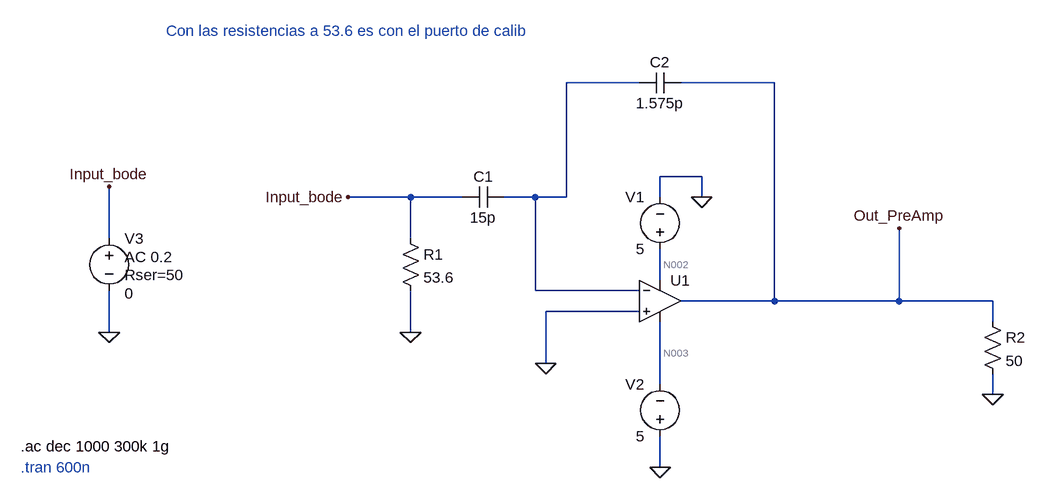
[diagram p0: schematic preamp_calib.asc]
preamp_calib.asc, the LTspice schematic file:
Version 4
SHEET 1 1032 680
WIRE 432 -64 320 -64
WIRE 640 -64 496 -64
WIRE 528 80 464 80
WIRE 80 112 -16 112
WIRE 160 112 80 112
WIRE 272 112 224 112
WIRE 320 112 320 -64
WIRE 320 112 272 112
WIRE 464 112 464 80
WIRE 528 112 528 80
WIRE -384 176 -384 96
WIRE 80 176 80 112
WIRE 464 240 464 192
WIRE 272 256 272 112
WIRE 432 256 272 256
WIRE 640 272 640 -64
WIRE 640 272 496 272
WIRE 832 272 832 160
WIRE 832 272 640 272
WIRE 976 272 832 272
WIRE 432 288 288 288
WIRE 976 304 976 272
WIRE -384 320 -384 256
WIRE 80 320 80 256
WIRE 288 368 288 288
WIRE 464 400 464 304
WIRE 976 416 976 384
WIRE 464 528 464 480
FLAG -384 320 0
FLAG -384 96 Input_bode
FLAG 464 528 0
FLAG 528 112 0
FLAG 288 368 0
FLAG 832 160 Out_PreAmp
FLAG -16 112 Input_bode
FLAG 80 320 0
FLAG 976 416 0
SYMBOL voltage 464 208 R180
WINDOW 0 24 96 Left 2
WINDOW 3 24 16 Left 2
WINDOW 123 0 0 Left 0
WINDOW 39 0 0 Left 0
SYMATTR InstName V1
SYMATTR Value 5
SYMBOL voltage 464 496 R180
WINDOW 0 24 96 Left 2
WINDOW 3 24 16 Left 2
WINDOW 123 0 0 Left 0
WINDOW 39 0 0 Left 0
SYMATTR InstName V2
SYMATTR Value 5
SYMBOL OpAmps\\UniversalOpAmp1 464 272 R0
SYMATTR InstName U1
SYMATTR Value2 Avol=1900 GBW=897.0831Meg Vos=0
SYMBOL voltage -384 160 R0
WINDOW 123 24 44 Left 2
WINDOW 39 24 72 Left 2
WINDOW 3 24 100 Left 2
SYMATTR Value2 AC 0.2
SYMATTR SpiceLine Rser=50
SYMATTR Value 0
SYMATTR InstName V3
SYMBOL cap 224 96 R90
WINDOW 0 0 32 VBottom 2
WINDOW 3 32 32 VTop 2
SYMATTR InstName C1
SYMATTR Value 15p
SYMATTR SpiceLine Rser=0
SYMBOL cap 496 -80 R90
WINDOW 0 0 32 VBottom 2
WINDOW 3 32 32 VTop 2
SYMATTR InstName C2
SYMATTR Value 1.575p
SYMATTR SpiceLine Rser=0
SYMBOL res 64 160 R0
SYMATTR InstName R1
SYMATTR Value 53.6
SYMBOL res 960 288 R0
SYMATTR InstName R2
SYMATTR Value 50
TEXT -520 528 Left 2 ;.tran 600n
TEXT -520 496 Left 2 !.ac dec 1000 300k 1g
TEXT -296 -144 Left 2 ;Con las resistencias a 53.6 es con el puerto de calib

The netlist it stands for:
* preamp_calib.asc
V1 N002 0 5
V2 0 N003 5
XU1 0 N001 N002 N003 Out_PreAmp level1 Avol=1900 GBW=897.0831Meg Vos=0 En=0 Enk=0 In=0 Ink=0 Rin=500Meg  ; pins In+ In- V+ V- OUT
V3 Input_bode 0 0 AC 0.2 Rser=50
C1 N001 Input_bode 15p Rser=0
C2 Out_PreAmp N001 1.575p Rser=0
R1 Input_bode 0 53.6
R2 Out_PreAmp 0 50
* .tran 600n
.ac dec 1000 300k 1g
* Con las resistencias a 53.6 es con el puerto de calib
.lib UniversalOpAmp1.lib
.backanno
.end

* Results of the author's LTspice run, read from the files saved beside the schematic
* Operating Point, zero values left out:
*   V(n002) = 5 V
*   V(n003) = -5 V
*   I(V1) = -10 nA
*   I(V2) = -10 nA
*   Ix(u1:3) = 10 nA
*   Ix(u1:4) = -10 nA
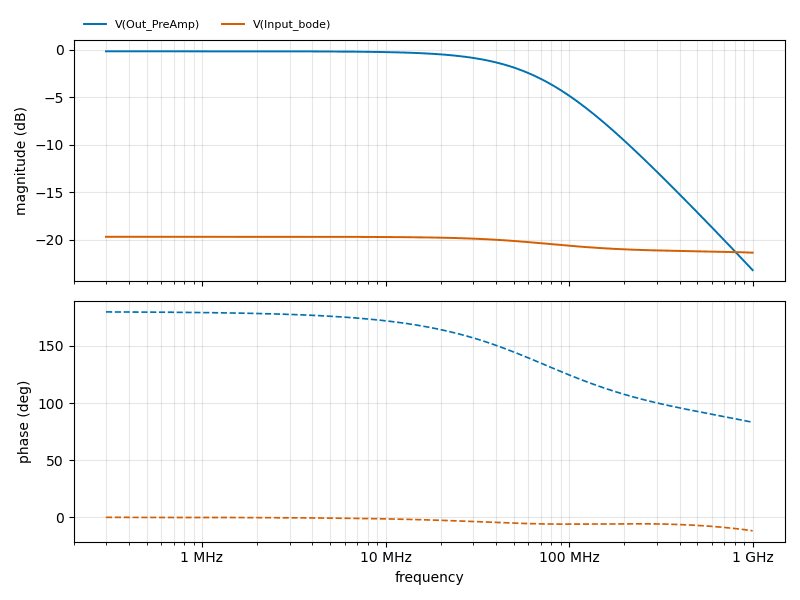
[diagram p1: AC Analysis of preamp_calib.asc, plotted from the saved traces]
* AC Analysis, 1 run:
*   V(Out_PreAmp): -0.18 dB at 300 kHz, -23.22 dB at 1 GHz, peak -0.18 dB at 300 kHz, 3 dB below the peak at 71.94 MHz
*   V(Input_bode): -19.70 dB at 300 kHz, -21.38 dB at 1 GHz, peak -19.70 dB at 300 kHz